# Altium schematic sheet H-00488 - USB Hub.SchDoc: 7-Port USB Hub (USB2517)
size 403 x 281 mm; DocumentNumber: 7; SheetNumber: 7; SheetTotal: 12
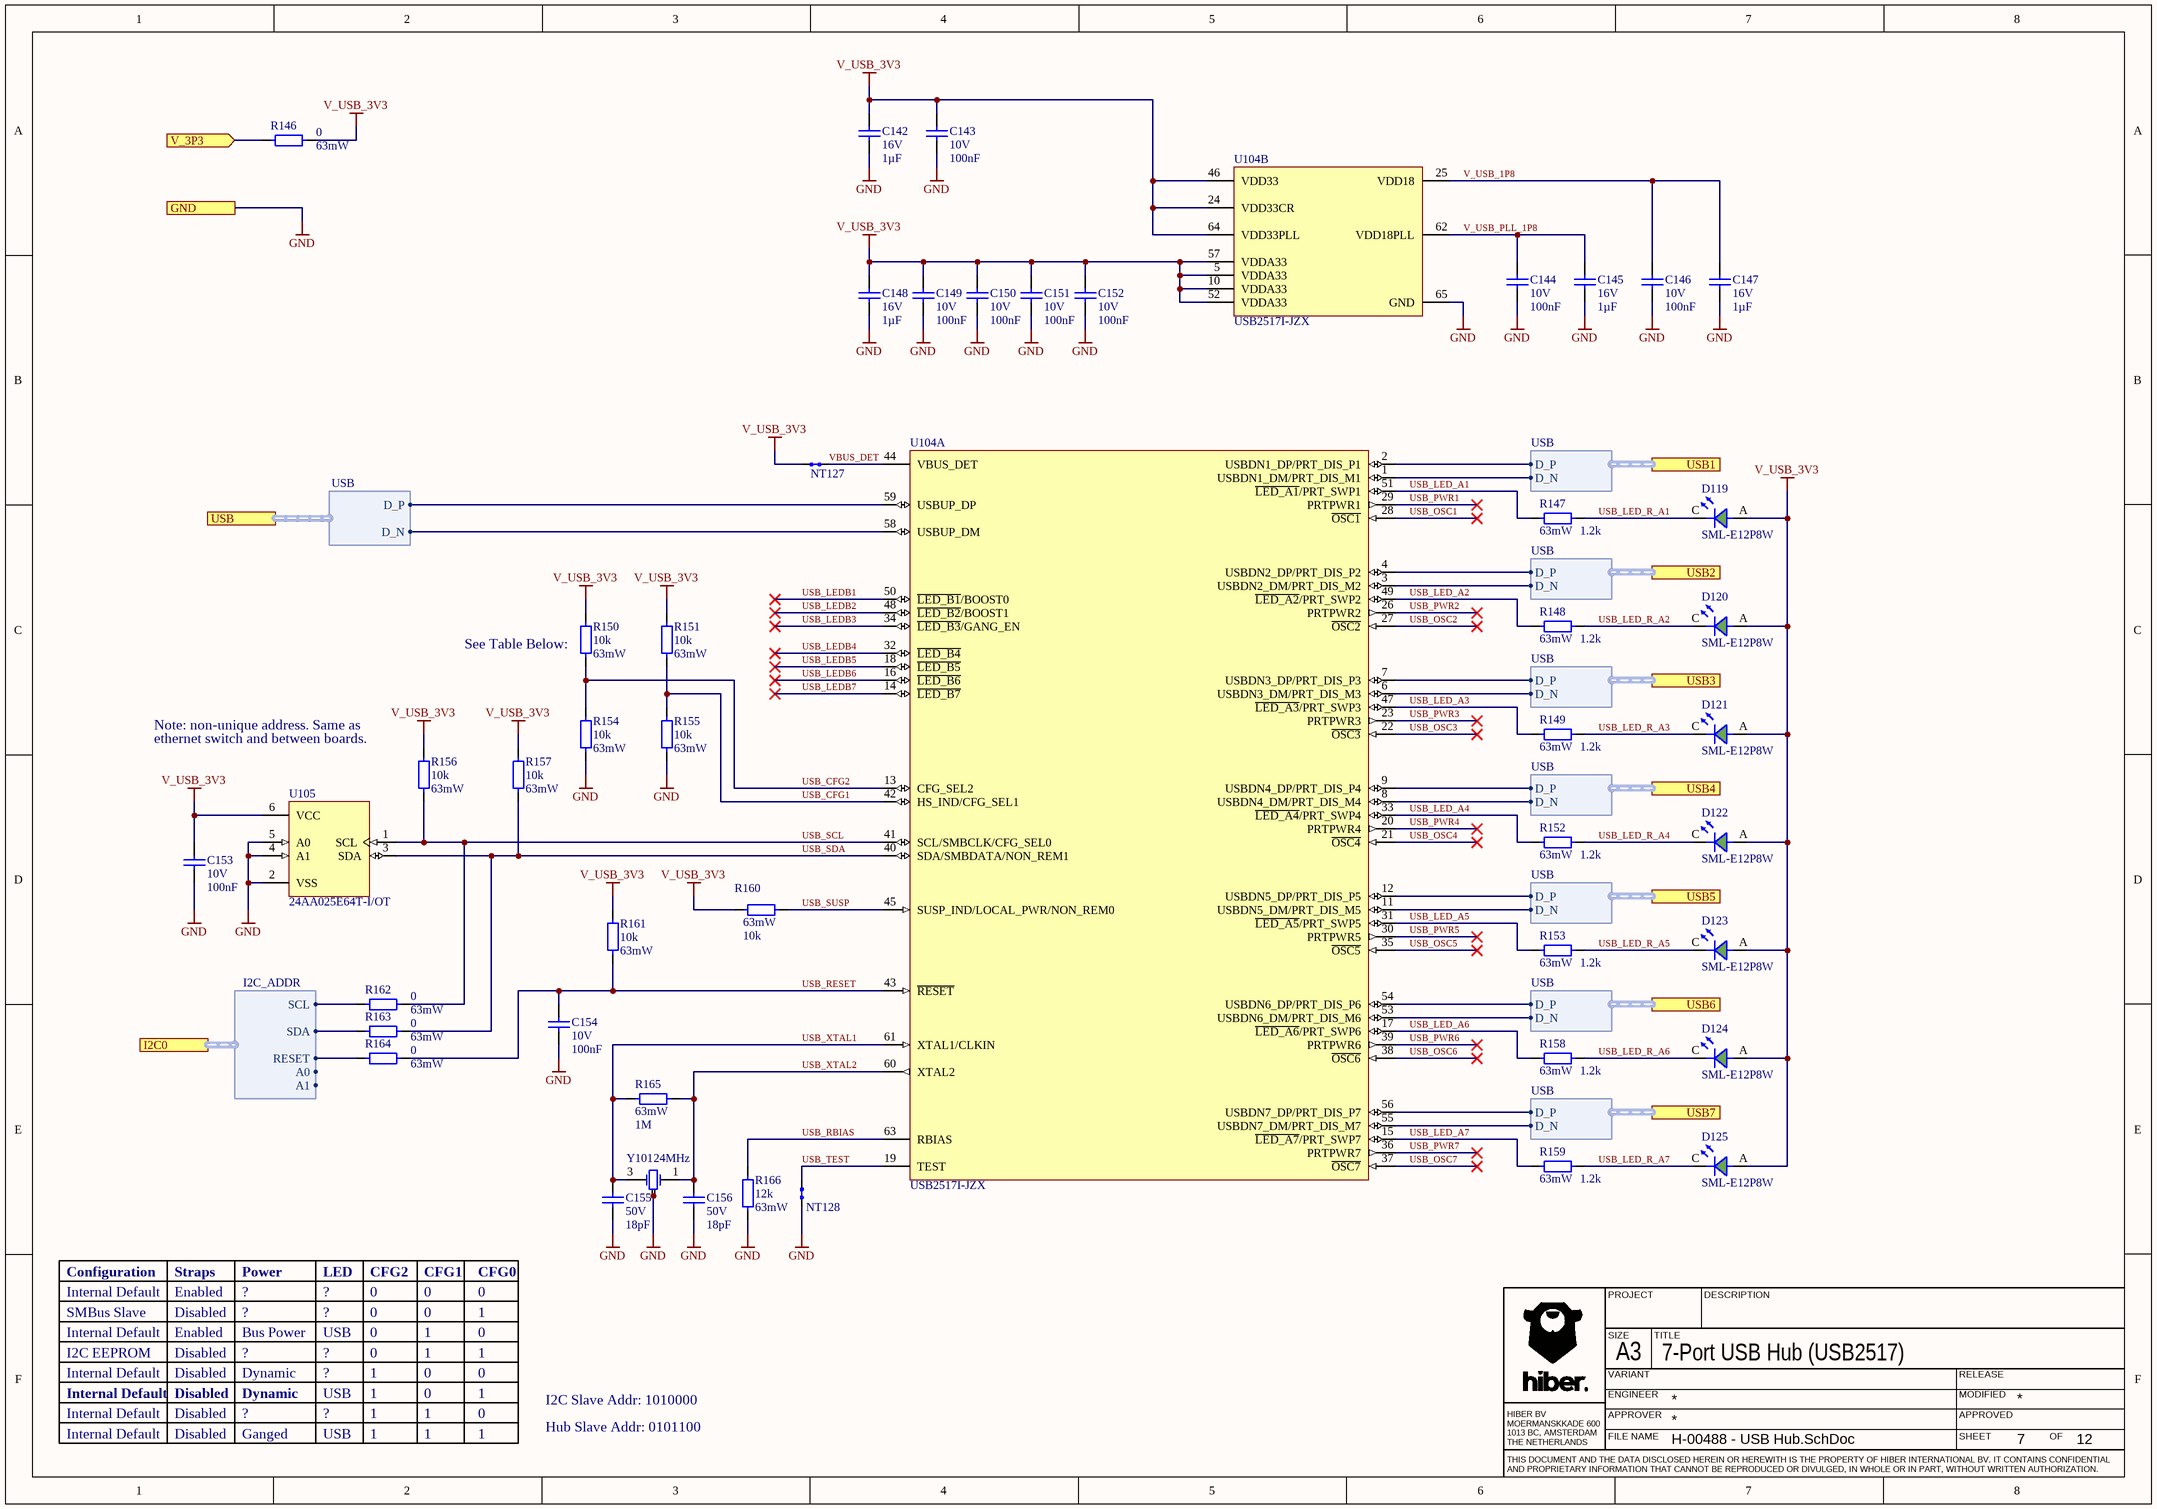
[diagram p0: H-00488 - USB Hub.SchDoc]

## Parts
C142  value 1µF  Rated Voltage: 16V  [CAPC100X50X55L30N]  (hidden comment: C0402C105K4PACTU)
C143  value 100nF  Rated Voltage: 10V  [CAPC100X50X55L30N]  (hidden comment: C0402C104K8RACTU)
C144  value 100nF  Rated Voltage: 10V  [CAPC100X50X55L30N]  (hidden comment: C0402C104K8RACTU)
C145  value 1µF  Rated Voltage: 16V  [CAPC100X50X55L30N]  (hidden comment: C0402C105K4PACTU)
C146  value 100nF  Rated Voltage: 10V  [CAPC100X50X55L30N]  (hidden comment: C0402C104K8RACTU)
C147  value 1µF  Rated Voltage: 16V  [CAPC100X50X55L30N]  (hidden comment: C0402C105K4PACTU)
C148  value 1µF  Rated Voltage: 16V  [CAPC100X50X55L30N]  (hidden comment: C0402C105K4PACTU)
C149  value 100nF  Rated Voltage: 10V  [CAPC100X50X55L30N]  (hidden comment: C0402C104K8RACTU)
C150  value 100nF  Rated Voltage: 10V  [CAPC100X50X55L30N]  (hidden comment: C0402C104K8RACTU)
C151  value 100nF  Rated Voltage: 10V  [CAPC100X50X55L30N]  (hidden comment: C0402C104K8RACTU)
C152  value 100nF  Rated Voltage: 10V  [CAPC100X50X55L30N]  (hidden comment: C0402C104K8RACTU)
C153  value 100nF  Rated Voltage: 10V  [CAPC100X50X55L30N]  (hidden comment: C0402C104K8RACTU)
C154  value 100nF  Rated Voltage: 10V  [CAPC100X50X55L30N]  (hidden comment: C0402C104K8RACTU)
C155  value 18pF  Rated Voltage: 50V  [CAPC100X50X55L30N]  (hidden comment: C0402C180J5GACTU)
C156  value 18pF  Rated Voltage: 50V  [CAPC100X50X55L30N]  (hidden comment: C0402C180J5GACTU)
D119  SML-E12P8W  [LEDC170X80X80L20_GREEN]
D120  SML-E12P8W  [LEDC170X80X80L20_GREEN]
D121  SML-E12P8W  [LEDC170X80X80L20_GREEN]
D122  SML-E12P8W  [LEDC170X80X80L20_GREEN]
D123  SML-E12P8W  [LEDC170X80X80L20_GREEN]
D124  SML-E12P8W  [LEDC170X80X80L20_GREEN]
D125  SML-E12P8W  [LEDC170X80X80L20_GREEN]
NT127  NET-TIE  [NT200]  (value not drawn)  (net tie, no BOM)
NT128  NET-TIE  [NT200]  (value not drawn)  (net tie, no BOM)
R146  value 0  Rated Power: 63mW  [RESC100X50X40L25N]  (hidden comment: CRCW04020000Z0ED)
R147  value 1.2k  Rated Power: 63mW  [RESC100X50X40L25N]  (hidden comment: CRCW04021K20FKED)
R148  value 1.2k  Rated Power: 63mW  [RESC100X50X40L25N]  (hidden comment: CRCW04021K20FKED)
R149  value 1.2k  Rated Power: 63mW  [RESC100X50X40L25N]  (hidden comment: CRCW04021K20FKED)
R150  value 10k  Rated Power: 63mW  [RESC100X50X40L25N]  (hidden comment: CRCW040210K0FKED)
R151  value 10k  Rated Power: 63mW  [RESC100X50X40L25N]  (hidden comment: CRCW040210K0FKED)
R152  value 1.2k  Rated Power: 63mW  [RESC100X50X40L25N]  (hidden comment: CRCW04021K20FKED)
R153  value 1.2k  Rated Power: 63mW  [RESC100X50X40L25N]  (hidden comment: CRCW04021K20FKED)
R154  value 10k  Rated Power: 63mW  [RESC100X50X40L25N]  (hidden comment: CRCW040210K0FKED)
R155  value 10k  Rated Power: 63mW  [RESC100X50X40L25N]  (hidden comment: CRCW040210K0FKED)
R156  value 10k  Rated Power: 63mW  [RESC100X50X40L25N]  (hidden comment: CRCW040210K0FKED)
R157  value 10k  Rated Power: 63mW  [RESC100X50X40L25N]  (hidden comment: CRCW040210K0FKED)
R158  value 1.2k  Rated Power: 63mW  [RESC100X50X40L25N]  (hidden comment: CRCW04021K20FKED)
R159  value 1.2k  Rated Power: 63mW  [RESC100X50X40L25N]  (hidden comment: CRCW04021K20FKED)
R160  value 10k  Rated Power: 63mW  [RESC100X50X40L25N]  (hidden comment: CRCW040210K0FKED)
R161  value 10k  Rated Power: 63mW  [RESC100X50X40L25N]  (hidden comment: CRCW040210K0FKED)
R162  value 0  Rated Power: 63mW  [RESC100X50X40L25N]  (hidden comment: CRCW04020000Z0ED)
R163  value 0  Rated Power: 63mW  [RESC100X50X40L25N]  (hidden comment: CRCW04020000Z0ED)
R164  value 0  Rated Power: 63mW  [RESC100X50X40L25N]  (hidden comment: CRCW04020000Z0ED)
R165  value 1M  Rated Power: 63mW  [RESC100X50X40L25N]  (hidden comment: CRCW04021M00FKED)
R166  value 12k  Rated Power: 63mW  [RESC100X50X40L25N]  (hidden comment: CRCW040212K0FKED)
U104  USB2517I-JZX  [QFN65P50_900X900X100L40X24T470N]  (parts A,B of 2)
U105  24AA025E64T-I/OT  [SOT23-6P95_270X145L35X35]
Y101  Frequency: 24MHz  [OSCCC320X250X60L90X110]  (hidden comment: TSX-322524.0000MF15X-AC3)

## Ports
GND, I2C0 (harness I2C_ADDR), USB1 (harness USB), USB2 (harness USB), USB3 (harness USB), USB4 (harness USB), USB5 (harness USB), USB6 (harness USB), USB7 (harness USB), USB (harness USB), V_3P3 (in)

## Harnesses
USB: D_P, D_N
I2C_ADDR: SDA, SCL, A0, A1, RESET

## Nets
GND: C142.1 C143.2 C144.2 C145.1 C146.2 C147.1 C148.1 C149.2 C150.2 C151.2 C152.2 C153.2 C154.2 C155.2 C156.2 NT128.2 R154.2 R155.2 R166.1 U104.65(GND) U105.2(VSS) U105.4(A1) U105.5(A0) Y101.2 Y101.4 ; port GND
V_USB_3V3: C142.2 C143.1 C148.2 C149.1 C150.1 C151.1 C152.1 C153.1 D119.A D120.A D121.A D122.A D123.A D124.A D125.A NT127.1 R146.2 R150.1 R151.1 R156.1 R157.1 R160.1 R161.1 U104.5(VDDA33) U104.10(VDDA33) U104.24(VDD33CR) U104.46(VDD33) U104.52(VDDA33) U104.57(VDDA33) U104.64(VDD33PLL) U105.6(VCC)
USB_CFG1: R151.2 R155.1 U104.42(HS_IND/CFG_SEL1)
USB_CFG2: R150.2 R154.1 U104.13(CFG_SEL2)
USB_LED_A1: R147.2 U104.51(~{LED_A1}/PRT_SWP1)
USB_LED_A2: R148.2 U104.49(~{LED_A2}/PRT_SWP2)
USB_LED_A3: R149.2 U104.47(~{LED_A3}/PRT_SWP3)
USB_LED_A4: R152.2 U104.33(~{LED_A4}/PRT_SWP4)
USB_LED_A5: R153.2 U104.31(~{LED_A5}/PRT_SWP5)
USB_LED_A6: R158.2 U104.17(~{LED_A6}/PRT_SWP6)
USB_LED_A7: R159.2 U104.15(~{LED_A7}/PRT_SWP7)
USB_LED_R_A1: D119.C R147.1
USB_LED_R_A2: D120.C R148.1
USB_LED_R_A3: D121.C R149.1
USB_LED_R_A4: D122.C R152.1
USB_LED_R_A5: D123.C R153.1
USB_LED_R_A6: D124.C R158.1
USB_LED_R_A7: D125.C R159.1
USB_LEDB1: U104.50(~{LED_B1}/BOOST0)
USB_LEDB2: U104.48(~{LED_B2}/BOOST1)
USB_LEDB3: U104.34(~{LED_B3}/GANG_EN)
USB_LEDB4: U104.32(~{LED_B4})
USB_LEDB5: U104.18(~{LED_B5})
USB_LEDB6: U104.16(~{LED_B6})
USB_LEDB7: U104.14(~{LED_B7})
USB_OSC1: U104.28(~{OSC1})
USB_OSC2: U104.27(~{OSC2})
USB_OSC3: U104.22(~{OSC3})
USB_OSC4: U104.21(~{OSC4})
USB_OSC5: U104.35(~{OSC5})
USB_OSC6: U104.38(~{OSC6})
USB_OSC7: U104.37(~{OSC7})
USB_PWR1: U104.29(PRTPWR1)
USB_PWR2: U104.26(PRTPWR2)
USB_PWR3: U104.23(PRTPWR3)
USB_PWR4: U104.20(PRTPWR4)
USB_PWR5: U104.30(PRTPWR5)
USB_PWR6: U104.39(PRTPWR6)
USB_PWR7: U104.36(PRTPWR7)
USB_RBIAS: R166.2 U104.63(RBIAS)
USB_RESET: C154.1 R161.2 R164.2 U104.43(~{RESET})
USB_SCL: R156.2 R162.2 U104.41(SCL/SMBCLK/CFG_SEL0) U105.1(SCL)
USB_SDA: R157.2 R163.1 U104.40(SDA/SMBDATA/NON_REM1) U105.3(SDA)
USB_SUSP: R160.2 U104.45(SUSP_IND/LOCAL_PWR/NON_REM0)
USB_TEST: NT128.1 U104.19(TEST)
USB_XTAL1: C155.1 R165.1 U104.61(XTAL1/CLKIN) Y101.3
USB_XTAL2: C156.1 R165.2 U104.60(XTAL2) Y101.1
V_3P3: R146.1 ; port V_3P3
V_USB_1P8: C146.1 C147.2 U104.25(VDD18)
V_USB_PLL_1P8: C144.1 C145.2 U104.62(VDD18PLL)
VBUS_DET: NT127.2 U104.44(VBUS_DET)
NetR162_1: R162.1 ; port I2C0.SCL
NetR163_2: R163.2 ; port I2C0.SDA
NetR164_1: R164.1 ; port I2C0.RESET
NetU104_1: U104.1(USBDN1_DM/PRT_DIS_M1) ; port USB1.D_N
NetU104_2: U104.2(USBDN1_DP/PRT_DIS_P1) ; port USB1.D_P
NetU104_3: U104.3(USBDN2_DM/PRT_DIS_M2) ; port USB2.D_N
NetU104_4: U104.4(USBDN2_DP/PRT_DIS_P2) ; port USB2.D_P
NetU104_6: U104.6(USBDN3_DM/PRT_DIS_M3) ; port USB3.D_N
NetU104_7: U104.7(USBDN3_DP/PRT_DIS_P3) ; port USB3.D_P
NetU104_8: U104.8(USBDN4_DM/PRT_DIS_M4) ; port USB4.D_N
NetU104_9: U104.9(USBDN4_DP/PRT_DIS_P4) ; port USB4.D_P
NetU104_11: U104.11(USBDN5_DM/PRT_DIS_M5) ; port USB5.D_N
NetU104_12: U104.12(USBDN5_DP/PRT_DIS_P5) ; port USB5.D_P
NetU104_53: U104.53(USBDN6_DM/PRT_DIS_M6) ; port USB6.D_N
NetU104_54: U104.54(USBDN6_DP/PRT_DIS_P6) ; port USB6.D_P
NetU104_55: U104.55(USBDN7_DM/PRT_DIS_M7) ; port USB7.D_N
NetU104_56: U104.56(USBDN7_DP/PRT_DIS_P7) ; port USB7.D_P
NetU104_58: U104.58(USBUP_DM) ; port USB.D_N
NetU104_59: U104.59(USBUP_DP) ; port USB.D_P

## Notes on the sheet
- (near R150) See Table Below:
- (near R156) Note: non-unique address. Same as
- (near R156) ethernet switch and between boards.
- Configuration
- SMBus Slave
- Internal Default
- Straps
- Enabled
- Disabled
- Power
- ?
- LED
- CFG2
- 0
- CFG1
- CFG0
- 1
- I2C EEPROM
- Bus Power
- Dynamic
- USB
- Ganged
- Hub Slave Addr: 0101100
- I2C Slave Addr: 1010000
- PROJECT
- DESCRIPTION
- SIZE
- ENGINEER
- VARIANT
- A3
- TITLE
- MODIFIED
- RELEASE
- HIBER BV
  MOERMANSKKADE 600
  1013 BC, AMSTERDAM
  THE NETHERLANDS
- FILE NAME
- APPROVER
- SHEET
- APPROVED
- OF
- THIS DOCUMENT AND THE DATA DISCLOSED HEREIN OR HEREWITH IS THE PROPERTY OF HIBER INTERNATIONAL BV. IT CONTAINS CONFIDENTIAL AND PROPRIETARY INFORMATION THAT CANNOT BE REPRODUCED OR DIVULGED, IN WHOLE OR IN PART, WITHOUT WRITTEN AUTHORIZATION.

## Library data of the parts
C142 C145 C147 C148 = CMP-00827-3: CAP Standard 0402 (1005) 1,0uF 16V X5R (Standard); Tolerance: 10%; Type: Ceramic; Qualification: Standard; RoHS: Yes; Failure Rate: N/A; Termination Finish: 100% Matte Sn; Pins: 2; Dielectric: X5R; Mount: SMD; Case/Package: 0402 (1005)
C143 C144 C146 C149-C154 = CMP-00367-3: CAP Standard 0402 (1005) 100,0nF 10V X7R (Standard); Type: Ceramic; Tolerance: 10%; Termination Finish: 100% Matte Sn; Qualification: Standard; RoHS: Yes; Mount: SMT; Case/Package: 0402 (1005); Failure Rate: N/A; Pins: 2; Dielectric: X7R
C155 C156 = CMP-00401-3: CAP Standard 0402 (1005) 18,0pF 50V C0G (Standard); Type: Ceramic; Tolerance: 5%; Termination Finish: 100% Matte Sn; Qualification: Standard; RoHS: Yes; Mount: SMD; Case/Package: 0402 (1005); Failure Rate: N/A; Pins: 2; Dielectric: C0G
D119-D125 = CMP-00431-1: LED Green Diffused 0603 SMD; Dominant Wavelength: 630nm; Viewing Angle: 140°; Test Current: 20mA; Forward Voltage: 2,5V; Typical Wavelength: 560nm; Number of LEDs: 1; Lens Style: Clear, Colorless, Diffused, Rectangular; Luminous Intensity: 6.3mcd; Chip Structure: AlGaInP; Illumination Colour: Red; Lens Colour: White; Package Quantity: 1; Max Operating Temperature: 85°C; Width: 0.8mm; Case Code (Imperial): 0603; Length: 1.6mm; Lens Transparency: Diffused; Lead Free: Lead Free; Number of Pins: 2; Mount: Surface Mount; Height: 0.46mm; Color: Green; Case/Package: 0603; Forward Current: 20mA; Radiation Hardening: No; Min Operating Temperature: -40°C; Wavelength: 630nm; Case Code (Metric): 1608; Packaging: Tape and Reel
NT127 NT128 = CMP-00523-9: Net Tie, Inline
R146 R162-R164 = CMP-00197-9: RES Standard Thick Film 0402 0R00 ±1% 0,063W; Qualification: Automotive; Rated Voltage: 50V; Case/Package: 0402 (1005); Tolerance: 1%; Pins: 2; Termination Finish: Pure tin solder contacts on Ni barrier layer; Failure Rate: N/A; RoHS: Yes; Type: Standard Thick Film; Mount: Surface Mount
R147-R149 R152 R153 R158 R159 = CMP-00272-8: RES Standard Thick Film 0402 1K20 ±1% 0,063W; Qualification: Automotive; Rated Voltage: 50V; Mount: Surface Mount; Termination Finish: Pure tin solder contacts on Ni barrier layer; Case/Package: 0402 (1005); Pins: 2; Tolerance: 1%; Failure Rate: N/A; Type: Standard Thick Film; RoHS: Yes
R150 R151 R154-R157 R160 R161 = CMP-00294-7: RES Standard Thick Film 0402 10K0 ±1% 0,063W; Qualification: Automotive; Rated Voltage: 50V; Case/Package: 0402 (1005); Pins: 2; RoHS: Yes; Mount: Surface Mount; Tolerance: 1%; Termination Finish: Pure tin solder contacts on Ni barrier layer; Failure Rate: N/A; Type: Standard Thick Film
R165 = CMP-00342-7: RES Standard Thick Film 0402 1M00 ±1% 0,063W; Rated Voltage: 50V; Qualification: Automotive; Pins: 2; Mount: Surface Mount; Tolerance: 1%; Case/Package: 0402 (1005); Termination Finish: Pure tin solder contacts on Ni barrier layer; Failure Rate: N/A; RoHS: Yes; Type: Standard Thick Film
R166 = CMP-00296-7: RES Standard Thick Film 0402 12K0 ±1% 0,063W; Rated Voltage: 50V; Qualification: Automotive; Tolerance: 1%; Termination Finish: Pure tin solder contacts on Ni barrier layer; Pins: 2; RoHS: Yes; Mount: Surface Mount; Case/Package: 0402 (1005); Type: Standard Thick Film; Failure Rate: N/A
U104 = CMP-01073-9: USB Bus Controller, CMOS; Qualification Status: Not Qualified; Max Supply Voltage: 3.6V; Supply Voltage-Nom: 3.3V; Min Supply Voltage: 3V; Max Frequency: 24MHz; Package Shape: Square; Temperature Grade: INDUSTRIAL; Width: 9mm; Length: 9mm; Terminal Position: QUAD; Technology: CMOS; Min Operating Temperature: -40°C; Height - Seated (Max): 1mm; Package Code: HVQCCN; Package Style: CHIP CARRIER, HEAT SINK/SLUG, VERY THIN PROFILEMeter; Surface Mount: Yes; Number of Pins: 64; Terminal Form: No Lead; Terminal Pitch: 0.5mm; Max Operating Temperature: 85°C
U105 = CMP-01106-2: EEPROM, 256X8, Serial, CMOS, PDSO5; Time @ Peak Reflow Temperature-Max (s): 40s; Serial Bus Type: I2C; Terminal Finish: Tin; Peak Reflow Temperature (Cel): 260°C; Memory Type: EEPROM; Moisture Sensitivity Level: 1; JESD-609 Code: e3
Y101 = CMP-00387-3: Parallel - Fundamental Quartz Crystal, 24MHz Nom; Frequency Tolerance: 10ppm; ESR (Equivalent Series Resistance): 40R; Load Capacitance: 9pF; Frequency Stability: 15ppm; Qualification: Standard; Mount: Surface Mount; Package Quantity: 250; RoHS: Yes; Max Operating Temperature: 85°C; Packaging: Tape and Reel; Height: 0.024inch; Length: 0.126inch; Weight: 0.000564oz; Width: 0.098inch; Tolerance: 10ppm; Min Operating Temperature: -40°C; Lead Free: Lead Free; Termination: SMD/SMT; Case/Package: SMD/SMT